# Altium schematic sheet DRV.SchDoc
size A4; SheetNumber: 5; SheetTotal: 6
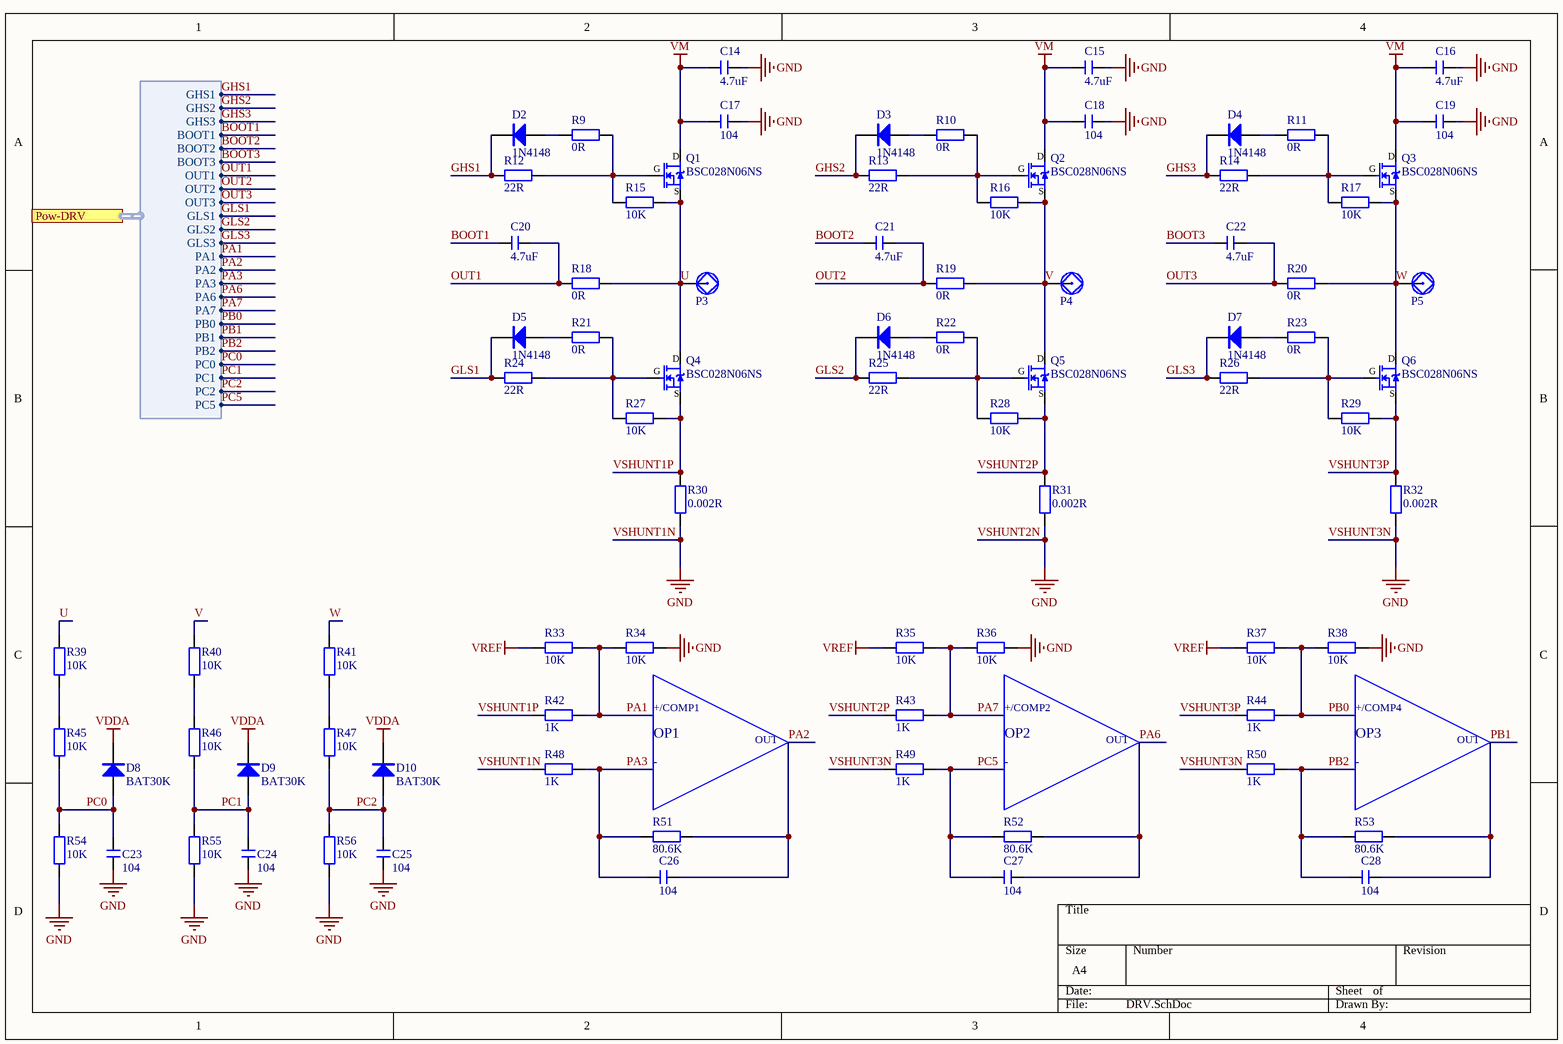
[diagram p0: DRV.SchDoc]

## Parts
C14  4.7uF  [C 1206_L]
C15  4.7uF  [C 1206_L]
C16  4.7uF  [C 1206_L]
C17  104  [C 0603_L]
C18  104  [C 0603_L]
C19  104  [C 0603_L]
C20  4.7uF  [C 0805_L]
C21  4.7uF  [C 0805_L]
C22  4.7uF  [C 0805_L]
C23  104  [C 0603_L]
C24  104  [C 0603_L]
C25  104  [C 0603_L]
C26  104  [C 0603_L]
C27  104  [C 0603_L]
C28  104  [C 0603_L]
D2  1N4148  [SOD-323]
D3  1N4148  [SOD-323]
D4  1N4148  [SOD-323]
D5  1N4148  [SOD-323]
D6  1N4148  [SOD-323]
D7  1N4148  [SOD-323]
D8  BAT30K  [SOD-523]
D9  BAT30K  [SOD-523]
D10  BAT30K  [SOD-523]
P3  功率焊盘  [功率焊盘]  (value not drawn)
P4  功率焊盘  [功率焊盘]  (value not drawn)
P5  功率焊盘  [功率焊盘]  (value not drawn)
Q1  BSC028N06NS  [BSC028N06NS]
Q2  BSC028N06NS  [BSC028N06NS]
Q3  BSC028N06NS  [BSC028N06NS]
Q4  BSC028N06NS  [BSC028N06NS]
Q5  BSC028N06NS  [BSC028N06NS]
Q6  BSC028N06NS  [BSC028N06NS]
R9  0R  [R 0603_L]
R10  0R  [R 0603_L]
R11  0R  [R 0603_L]
R12  22R  [R 0603_L]
R13  22R  [R 0603_L]
R14  22R  [R 0603_L]
R15  10K  [R 0603_L]
R16  10K  [R 0603_L]
R17  10K  [R 0603_L]
R18  0R  [R 0603_L]
R19  0R  [R 0603_L]
R20  0R  [R 0603_L]
R21  0R  [R 0603_L]
R22  0R  [R 0603_L]
R23  0R  [R 0603_L]
R24  22R  [R 0603_L]
R25  22R  [R 0603_L]
R26  22R  [R 0603_L]
R27  10K  [R 0603_L]
R28  10K  [R 0603_L]
R29  10K  [R 0603_L]
R30  0.002R  [R 2512_M]
R31  0.002R  [R 2512_M]
R32  0.002R  [R 2512_M]
R33  10K  [R 0603_L]
R34  10K  [R 0603_L]
R35  10K  [R 0603_L]
R36  10K  [R 0603_L]
R37  10K  [R 0603_L]
R38  10K  [R 0603_L]
R39  10K  [R 0603_L]
R40  10K  [R 0603_L]
R41  10K  [R 0603_L]
R42  1K  [R 0603_L]
R43  1K  [R 0603_L]
R44  1K  [R 0603_L]
R45  10K  [R 0603_L]
R46  10K  [R 0603_L]
R47  10K  [R 0603_L]
R48  1K  [R 0603_L]
R49  1K  [R 0603_L]
R50  1K  [R 0603_L]
R51  80.6K  [R 0603_L]
R52  80.6K  [R 0603_L]
R53  80.6K  [R 0603_L]
R54  10K  [R 0603_L]
R55  10K  [R 0603_L]
R56  10K  [R 0603_L]

## Ports
Pow-DRV (harness Pow-DRV, see TopLevel[3A], MCU[4A])

## Harnesses
Pow-DRV: GHS1, GHS2, GHS3, BOOT1, BOOT2, BOOT3, OUT1, OUT2, OUT3, GLS1, GLS2, GLS3, PA1, PA2, PA3, PA6, PA7, PB0, PB1, PB2, PC5, PC0, PC1, PC2

## Nets
VDDA: D8.2(K) D9.2(K) D10.2(K)
VM: C14.2 C15.2 C16.2 C17.2 C18.2 C19.2 Q1.3(D) Q2.3(D) Q3.3(D)
VREF: R33.2 R35.2 R37.2
VSHUNT1N: C14.1 C15.1 C16.1 C17.1 C18.1 C19.1 C23.2 C24.2 C25.2 R30.2 R31.2 R32.2 R34.1 R36.1 R38.1 R48.2 R49.2 R50.2 R54.2 R55.2 R56.2  [also labelled GND, VSHUNT2N, VSHUNT3N]
BOOT1: C20.2 ; port Pow-DRV.BOOT1
BOOT2: C21.2 ; port Pow-DRV.BOOT2
BOOT3: C22.2 ; port Pow-DRV.BOOT3
GHS1: D2.2(K) R12.2 ; port Pow-DRV.GHS1
GHS2: D3.2(K) R13.2 ; port Pow-DRV.GHS2
GHS3: D4.2(K) R14.2 ; port Pow-DRV.GHS3
GLS1: D5.2(K) R24.2 ; port Pow-DRV.GLS1
GLS2: D6.2(K) R25.2 ; port Pow-DRV.GLS2
GLS3: D7.2(K) R26.2 ; port Pow-DRV.GLS3
OUT1: C20.1 R18.2 ; port Pow-DRV.OUT1
OUT2: C21.1 R19.2 ; port Pow-DRV.OUT2
OUT3: C22.1 R20.2 ; port Pow-DRV.OUT3
PA1: R33.1 R34.2 R42.1 ; port Pow-DRV.PA1
PA2: C26.1 R51.1 ; port Pow-DRV.PA2
PA3: C26.2 R48.1 R51.2 ; port Pow-DRV.PA3
PA6: C27.1 R52.1 ; port Pow-DRV.PA6
PA7: R35.1 R36.2 R43.1 ; port Pow-DRV.PA7
PB0: R37.1 R38.2 R44.1 ; port Pow-DRV.PB0
PB1: C28.1 R53.1 ; port Pow-DRV.PB1
PB2: C28.2 R50.1 R53.2 ; port Pow-DRV.PB2
PC0: C23.1 D8.1(A) R45.2 R54.1 ; port Pow-DRV.PC0
PC1: C24.1 D9.1(A) R46.2 R55.1 ; port Pow-DRV.PC1
PC2: C25.1 D10.1(A) R47.2 R56.1 ; port Pow-DRV.PC2
PC5: C27.2 R49.1 R52.2 ; port Pow-DRV.PC5
U: P3.1 Q1.1(S) Q4.3(D) R15.1 R18.1 R39.1
V: P4.1 Q2.1(S) Q5.3(D) R16.1 R19.1 R40.1
VSHUNT1P: Q4.1(S) R27.1 R30.1 R42.2
VSHUNT2P: Q5.1(S) R28.1 R31.1 R43.2
VSHUNT3P: Q6.1(S) R29.1 R32.1 R44.2
W: P5.1 Q3.1(S) Q6.3(D) R17.1 R20.1 R41.1
NetD2_1: D2.1(A) R9.2
NetD3_1: D3.1(A) R10.2
NetD4_1: D4.1(A) R11.2
NetD5_1: D5.1(A) R21.2
NetD6_1: D6.1(A) R22.2
NetD7_1: D7.1(A) R23.2
NetQ1_2: Q1.2(G) R9.1 R12.1 R15.2
NetQ2_2: Q2.2(G) R10.1 R13.1 R16.2
NetQ3_2: Q3.2(G) R11.1 R14.1 R17.2
NetQ4_2: Q4.2(G) R21.1 R24.1 R27.2
NetQ5_2: Q5.2(G) R22.1 R25.1 R28.2
NetQ6_2: Q6.2(G) R23.1 R26.1 R29.2
NetR39_2: R39.2 R45.1
NetR40_2: R40.2 R46.1
NetR41_2: R41.2 R47.1

## Notes on the sheet
- +/COMP1
- +/COMP2
- +/COMP4
- OP1
- -
- OUT
- OP2
- OP3

## Library data of the parts
C14-C28 = C: 无极性贴片电容; 版权归属: 源创客; BOM名称: 无极性贴片电容; 学习资源: www.ooocke.com
D2-D7 = 1N4148: 高速开关二极管; 版权归属: 源创客; BOM名称: 高速开关二极管; 学习资源: www.ooocke.com
D8-D10 = SS14: 肖特基二极管; 版权归属: 源创客; 属性: 40V/1A; BOM名称: 肖特基二极管; 学习资源: www.ooocke.com
Q1-Q6 = BSC028N06NS: N沟场，60V/100A; BOM名称: N沟场效应管; 版权归属: 源创客; 学习资源: www.ooocke.com
R9-R56 = R: 贴片电阻; 版权归属: 源创客; BOM名称: 贴片电阻; 学习资源: www.ooocke.com